# EAGLE schematic HHKBLite2BT (EAGLE 6.5.0)
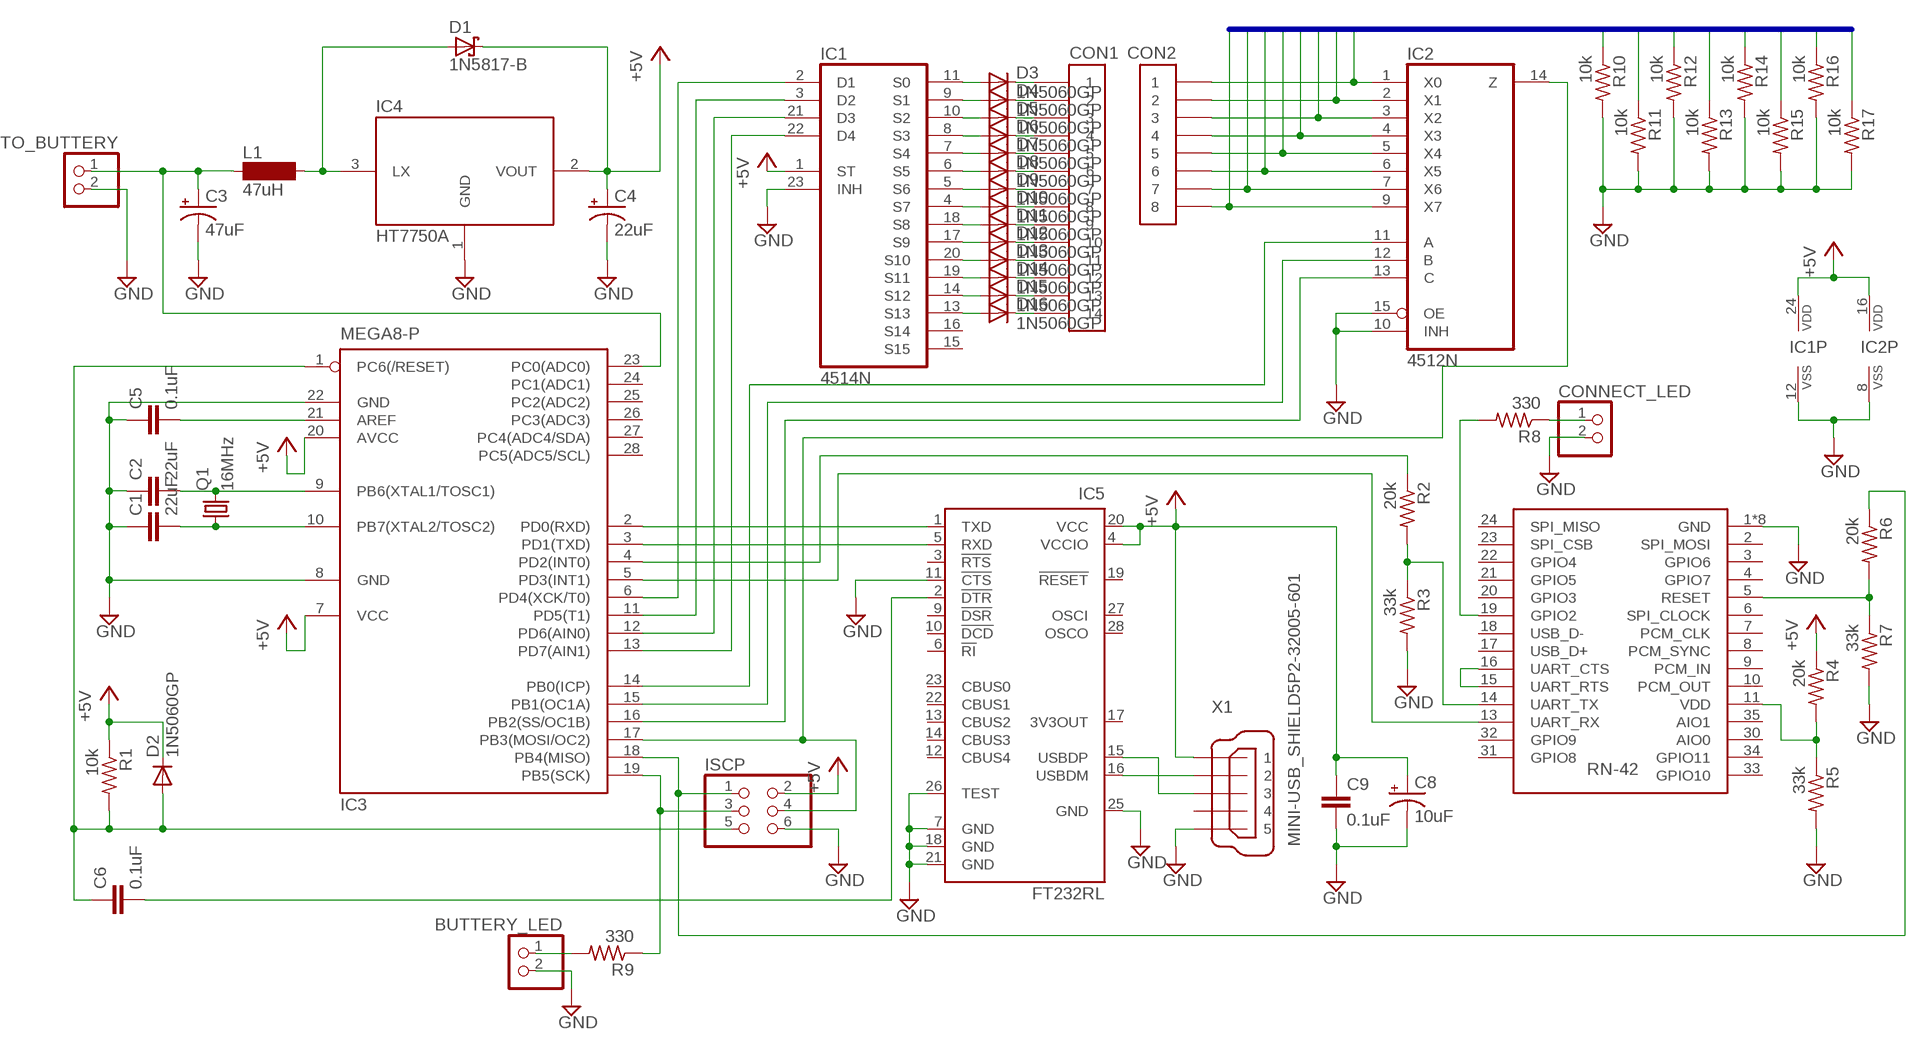
[diagram p0: schematic, sheet 1]

## Parts
BUTTERY_LED  PINHD-1X2  [1X02]
C1  22uF  C5/2.5  [C5B2.5]
C2  22uF  C5/2.5  [C5B2.5]
C3  47uF  CPOL-USE5-10.5  [E5-10,5]
C4  22uF  CPOL-USE5-10.5  [E5-10,5]
C5  0.1uF  C5/2.5  [C5B2.5]
C6  0.1uF  C5/2.5  [C5B2.5]
C8  10uF  CPOL-USE5-10.5  [E5-10,5]
C9  0.1uF  C5/2.5  [C5B2.5]
CON1  45045-1445  [52045-1445]
CON2  45045-0845  [52045-0845]
CONNECT_LED  PINHD-1X2  [1X02]
D1  1N5817-B  [DO41-7.6]
D2  1N5060GP  [DO15-12]
D3  1N5060GP  [DO15-12]
D4  1N5060GP  [DO15-12]
D5  1N5060GP  [DO15-12]
D6  1N5060GP  [DO15-12]
D7  1N5060GP  [DO15-12]
D8  1N5060GP  [DO15-12]
D9  1N5060GP  [DO15-12]
D10  1N5060GP  [DO15-12]
D11  1N5060GP  [DO15-12]
D12  1N5060GP  [DO15-12]
D13  1N5060GP  [DO15-12]
D14  1N5060GP  [DO15-12]
D15  1N5060GP  [DO15-12]
D16  1N5060GP  [DO15-12]
IC1  4514N  [DIL24-6]
IC2  4512N  [DIL16]
IC3  MEGA8-P  [DIL28-3]
IC4  HT7750A  [TO-92]
IC5  FT232RL  [SSOP28]
ISCP  PINHD-2X3  [2X03]
L1  47uH  BS11  [BS11]
Q1  16MHz  CRYSTALHC49S  [HC49/S]
R1  10k  R-US_0207/7  [0207/7]
R2  20k  R-US_0207/7  [0207/7]
R3  33k  R-US_0207/7  [0207/7]
R4  20k  R-US_0207/7  [0207/7]
R5  33k  R-US_0207/7  [0207/7]
R6  20k  R-US_0207/7  [0207/7]
R7  33k  R-US_0207/7  [0207/7]
R8  330  R-US_0207/7  [0207/7]
R9  330  R-US_0207/7  [0207/7]
R10  10k  R-US_0207/7  [0207/7]
R11  10k  R-US_0207/7  [0207/7]
R12  10k  R-US_0207/7  [0207/7]
R13  10k  R-US_0207/7  [0207/7]
R14  10k  R-US_0207/7  [0207/7]
R15  10k  R-US_0207/7  [0207/7]
R16  10k  R-US_0207/7  [0207/7]
R17  10k  R-US_0207/7  [0207/7]
TO_BUTTERY  PINHD-1X2  [1X02]
U$1  RN-42  [RN-42]
X1  MINI-USB_SHIELD5P2-32005-601  [32005-601]

## Nets
+5V: C4.+ C8.+ C9.1 D1.C D2.C IC1.1(ST) IC1.24(VDD) IC2.16(VDD) IC3.7(VCC) IC3.20(AVCC) IC4.2(VOUT) IC5.4(VCCIO) IC5.20(VCC) ISCP.2 R1.1 R4.1 X1.1
CON2BUS1: CON2.1 IC2.1(X0) R10.1
CON2BUS2: CON2.2 IC2.2(X1) R11.1
CON2BUS3: CON2.3 IC2.3(X2) R12.1
CON2BUS4: CON2.4 IC2.4(X3) R13.1
CON2BUS5: CON2.5 IC2.5(X4) R14.1
CON2BUS6: CON2.6 IC2.6(X5) R15.1
CON2BUS7: CON2.7 IC2.7(X6) R16.1
CON2BUS8: CON2.8 IC2.9(X7) R17.1
GND: BUTTERY_LED.2 C1.1 C2.1 C3.- C4.- C5.1 C8.- C9.2 CONNECT_LED.2 IC1.12(VSS) IC1.23(INH) IC2.8(VSS) IC2.10(INH) IC2.15(OE) IC3.8(GND) IC3.22(GND) IC4.1(GND) IC5.7(GND) IC5.11(!CTS) IC5.18(GND) IC5.21(GND) IC5.25(GND) IC5.26(TEST) ISCP.6 R3.2 R5.2 R7.2 R10.2 R11.2 R12.2 R13.2 R14.2 R15.2 R16.2 R17.2 TO_BUTTERY.2 U$1.1(GND) U$1.12(GND) U$1.28(GND) U$1.29(GND) U$1.GND1(GND) U$1.GND2(GND) U$1.GND3(GND) U$1.GND4(GND) X1.5
N$1: C2.2 IC3.9(PB6(XTAL1/TOSC1)) Q1.2
N$2: C1.2 IC3.10(PB7(XTAL2/TOSC2)) Q1.1
N$3: D1.A IC4.3(LX) L1.2
N$4: C3.+ IC3.23(PC0(ADC0)) L1.1 TO_BUTTERY.1
N$5: C5.2 IC3.21(AREF)
N$6: IC3.18(PB4(MISO)) ISCP.1 R6.1
N$7: IC3.19(PB5(SCK)) ISCP.3 R9.1
N$8: C6.1 D2.A IC3.1(PC6(/RESET)) ISCP.5 R1.2
N$9: IC2.14(Z) IC3.17(PB3(MOSI/OC2)) ISCP.4
N$10: IC5.16(USBDM) X1.2
N$11: IC3.2(PD0(RXD)) IC5.1(TXD)
N$12: IC3.3(PD1(TXD)) IC5.5(RXD)
N$13: C6.2 IC5.2(!DTR)
N$14: IC5.15(USBDP) X1.3
N$15: IC2.11(A) IC3.14(PB0(ICP))
N$16: IC2.12(B) IC3.15(PB1(OC1A))
N$17: IC2.13(C) IC3.16(PB2(SS/OC1B))
N$18: IC3.4(PD2(INT0)) R2.1
N$19: IC3.5(PD3(INT1)) U$1.13(UART_RX)
N$20: U$1.15(UART_RTS) U$1.16(UART_CTS)
N$21: R2.2 R3.1 U$1.14(UART_TX)
N$22: D3.A IC1.11(S0)
N$23: D4.A IC1.9(S1)
N$24: D5.A IC1.10(S2)
N$25: D6.A IC1.8(S3)
N$26: D7.A IC1.7(S4)
N$27: D8.A IC1.6(S5)
N$28: D9.A IC1.5(S6)
N$29: D10.A IC1.4(S7)
N$30: D11.A IC1.18(S8)
N$31: D12.A IC1.17(S9)
N$32: D13.A IC1.20(S10)
N$33: D14.A IC1.19(S11)
N$34: D15.A IC1.14(S12)
N$35: D16.A IC1.13(S13)
N$36: IC1.2(D1) IC3.6(PD4(XCK/T0))
N$37: IC1.3(D2) IC3.11(PD5(T1))
N$38: IC1.21(D3) IC3.12(PD6(AIN0))
N$39: IC1.22(D4) IC3.13(PD7(AIN1))
N$40: R8.2 U$1.19(GPIO2)
N$44: R4.2 R5.1 U$1.11(VDD)
N$45: CONNECT_LED.1 R8.1
N$46: R6.2 R7.1 U$1.5(RESET)
N$48: BUTTERY_LED.1 R9.2
N$49: CON1.1 D3.C
N$50: CON1.2 D4.C
N$51: CON1.3 D5.C
N$52: CON1.4 D6.C
N$53: CON1.5 D7.C
N$54: CON1.6 D8.C
N$55: CON1.7 D9.C
N$56: CON1.8 D10.C
N$57: CON1.9 D11.C
N$58: CON1.10 D12.C
N$59: CON1.11 D13.C
N$60: CON1.12 D14.C
N$61: CON1.13 D15.C
N$62: CON1.14 D16.C
Unconnected: IC1.15(S15) IC1.16(S14) IC3.24(PC1(ADC1)) IC3.25(PC2(ADC2)) IC3.26(PC3(ADC3)) IC3.27(PC4(ADC4/SDA)) IC3.28(PC5(ADC5/SCL)) IC5.3(!RTS) IC5.6(!RI) IC5.9(!DSR) IC5.10(!DCD) IC5.12(CBUS4) IC5.13(CBUS2) IC5.14(CBUS3) IC5.17(3V3OUT) IC5.19(!RESET) IC5.22(CBUS1) IC5.23(CBUS0) IC5.27(OSCI) IC5.28(OSCO) U$1.2(SPI_MOSI) U$1.3(GPIO6) U$1.4(GPIO7) U$1.6(SPI_CLOCK) U$1.7(PCM_CLK) U$1.8(PCM_SYNC) U$1.9(PCM_IN) U$1.10(PCM_OUT) U$1.17(USB_D+) U$1.18(USB_D-) U$1.20(GPIO3) U$1.21(GPIO5) U$1.22(GPIO4) U$1.23(SPI_CSB) U$1.24(SPI_MISO) U$1.30(AIO0) U$1.31(GPIO8) U$1.32(GPIO9) U$1.33(GPIO10) U$1.34(GPIO11) U$1.35(AIO1) X1.4 X1.M1(S1) X1.M2(S2)

## Buses
CON2BUS[1..8]

## Library data of the parts
BUTTERY_LED CONNECT_LED TO_BUTTERY = pinhead:PINHD-1X2: PIN HEADER
C1 C2 C5 C6 C9 = capacitor-wima:C: CAPACITOR naming: grid - package width
C3 C4 C8 = rcl:CPOL-US: POLARIZED CAPACITOR, American symbol
CON1 = 5204:45045-1445
CON2 = 5204:45045-0845
D1 = diode:1N581*: 1.0A SCHOTTKY BARRIER RECTIFIER Source: http://www.diodes.com/datasheets/ds23001.pdf
D2-D16 = diode:1N5060GP: DIODE controlled avalanche rectifier
IC1 = 45xx:4514: 4-bit latch 4-16 line DECODER
IC2 = 45xx:4512: 8-channel DATA SELECTOR Inhibit function corrected - 2005.10.04 librarian@cadsoft.de
IC3 = atmel:MEGA8-P: MICROCONTROLLER 8 Kbytes FLASH, 1 kbytes SRAM, 512 bytes EEPROM, USART, 4-channel 10 bit ADC, 2-channel 8 bit ADC Pin compatible with Atmega48, ATMega88, ATMega168 Source: avr.lbr; OC_FARNELL: unknown; OC_NEWARK: unknown
IC4 = HT77XXA:HT7750A
IC5 = ftdichip:FT232R: Source: http://www.ftdichip.com/Documents/DataSheets/DS_FT232R_v104.pdf; MPN: FT232RL; OC_FARNELL: 1146032; OC_NEWARK: 91K9918
ISCP = pinhead:PINHD-2X3: PIN HEADER
L1 = inductor-neosid:BS: INDUCTOR nominal inductance, magnetically screened; OC_FARNELL: unknown; OC_NEWARK: unknown
Q1 = crystal:CRYSTAL: CRYSTAL; OC_FARNELL: 1667008; OC_NEWARK: unknown
R1-R17 = rcl:R-US_: RESISTOR, American symbol
U$1 = RN-42:RN-42
X1 = con-cypressindustries:MINI-USB_SHIELD5P2-: MINI USB-B R/A DIP 5pol. Source: www.cypressindustries.com; OC_FARNELL: unknown; OC_NEWARK: unknown